# Altium schematic sheet SCH_Output.SchDoc
size A; DocumentNumber: 4; SheetNumber: 4; SheetTotal: 4
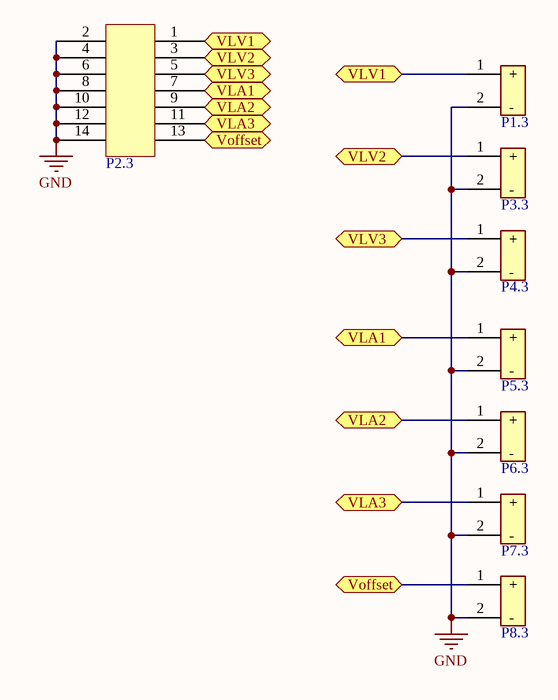
[diagram p0: SCH_Output.SchDoc]

## Parts
P1.3  SMA  [SMA]  (value not drawn)
P2.3  header_2x7  [hd_2x7]  (value not drawn)
P3.3  SMA  [SMA]  (value not drawn)
P4.3  SMA  [SMA]  (value not drawn)
P5.3  SMA  [SMA]  (value not drawn)
P6.3  SMA  [SMA]  (value not drawn)
P7.3  SMA  [SMA]  (value not drawn)
P8.3  SMA  [SMA]  (value not drawn)

## Ports
VLA1, VLA2, VLA3, VLV1, VLV2, VLV3, Voffset

## Nets
GND: P1.3.2(-) P2.3.2 P2.3.4 P2.3.6 P2.3.8 P2.3.10 P2.3.12 P2.3.14 P3.3.2(-) P4.3.2(-) P5.3.2(-) P6.3.2(-) P7.3.2(-) P8.3.2(-)
VLA1: P2.3.7 P5.3.1(+) ; port VLA1
VLA2: P2.3.9 P6.3.1(+) ; port VLA2
VLA3: P2.3.11 P7.3.1(+) ; port VLA3
VLV1: P1.3.1(+) P2.3.1 ; port VLV1
VLV2: P2.3.3 P3.3.1(+) ; port VLV2
VLV3: P2.3.5 P4.3.1(+) ; port VLV3
Voffset: P2.3.13 P8.3.1(+) ; port Voffset

## Library data of the parts
P1.3 P3.3 P4.3 P5.3 P6.3 P7.3 P8.3 = SMA 13,5
P2.3 = header_2x7pin